# Altium schematic sheet Nutaq_Adaptor2.SchDoc: Adaptador Nutaq
size A4; Author: RCP; DrawnBy: RCP; Engineer: RCP
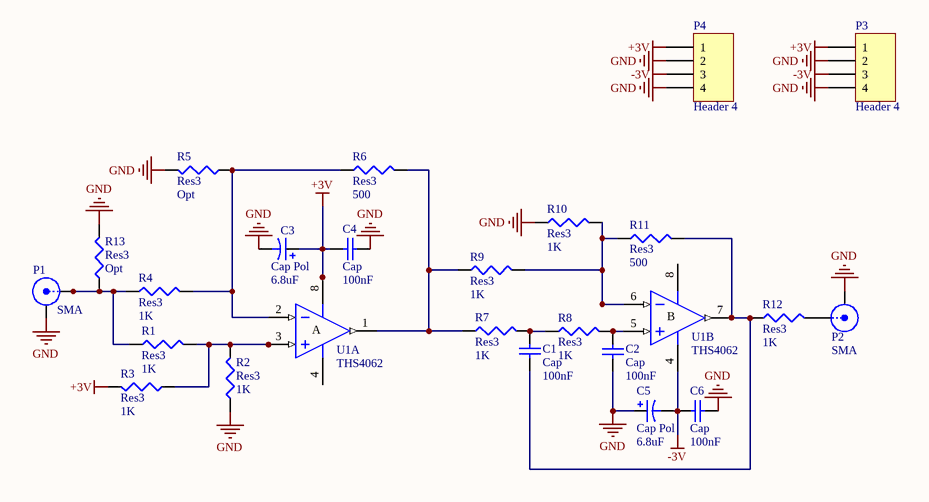
[diagram p0: Nutaq_Adaptor2.SchDoc]

## Parts
C1  Cap  value 100nF  [1608[0603]]
C2  Cap  value 100nF  [1608[0603]]
C3  Cap Pol  value 6.8uF  [1608[0603]]
C4  Cap  value 100nF  [1608[0603]]
C5  Cap Pol  value 6.8uF  [1608[0603]]
C6  Cap  value 100nF  [1608[0603]]
P1  SMA  [SMB_V-RJ45]
P2  SMA  [SMB_V-RJ45]
P3  Header 4  [HDR1X4]
P4  Header 4  [HDR1X4]
R1  Res3  value 1K  [J1-0603]
R2  Res3  value 1K  [J1-0603]
R3  Res3  value 1K  [J1-0603]
R4  Res3  value 1K  [J1-0603]
R5  Res3  value Opt  [J1-0603]
R6  Res3  value 500  [J1-0603]
R7  Res3  value 1K  [J1-0603]
R8  Res3  value 1K  [J1-0603]
R9  Res3  value 1K  [J1-0603]
R10  Res3  value 1K  [J1-0603]
R11  Res3  value 500  [J1-0603]
R12  Res3  value 1K  [J1-0603]
R13  Res3  value Opt  [J1-0603]
U1  THS4062  [SO-8_M]  (parts A,B of 2)

## Nets
+3V: C3.1 C4.1 P3.1 P4.1 R3.2 U1.8(V+)
-3V: C5.2 C6.1 P3.3 P4.3 U1.4(V-)
GND: C2.2 C3.2 C4.2 C5.1 C6.2 P1.2(Y) P2.2(Y) P3.2 P3.4 P4.2 P4.4 R2.1 R5.2 R10.1 R13.2
NetC1_1: C1.1 R7.2 R8.1
NetC1_2: C1.2 R11.2 R12.1 U1.7(OUT)
NetC2_1: C2.1 R8.2 U1.5(IN+)
NetP1_1: P1.1(X) R1.1 R4.1 R13.1
NetP2_1: P2.1(X) R12.2
NetR1_2: R1.2 R2.2 R3.1 U1.3(IN+)
NetR4_2: R4.2 R5.1 R6.1 U1.2(IN-)
NetR6_2: R6.2 R7.1 R9.1 U1.1(OUT)
NetR9_2: R9.2 R10.2 R11.1 U1.6(IN-)

## Notes on the sheet
- (in symbol AD8002AR, part A) A
- (in symbol AD8002AR, part B) B

## Library data of the parts
C1 C2 C4 C6 = Cap Semi: Capacitor (Semiconductor SIM Model); Published: 8-Jun-2000; LatestRevisionDate: 29-May-2009; LatestRevisionNote: IPC-7351 Footprint Added.; PackageReference: C1206; Publisher: Altium Limited; PackageDescription: Chip Capacitor
C3 C5 = Cap Pol3: Polarized Capacitor (Surface Mount); Published: 8-Jun-2000; LatestRevisionDate: 29-May-2009; LatestRevisionNote: IPC-7351 Footprint Added.; PackageReference: C0805; Publisher: Altium Limited; PackageDescription: Chip Capacitor
P1 P2 = SMB: SMB Straight Connector; LatestRevisionDate: 17-Jul-2002; LatestRevisionNote: Re-released for DXP Platform.; Publisher: Altium Limited
P3 P4 = Header 4: Header, 4-Pin; LatestRevisionDate: 17-Jul-2002; LatestRevisionNote: Re-released for DXP Platform.; Publisher: Altium Limited
R1-R13 = Res3: Resistor; Published: 8-Jun-2000; LatestRevisionDate: 29-May-2009; LatestRevisionNote: IPC-7351 Footprint Added.; PackageReference: J1-0603; Publisher: Altium Limited; PackageDescription: Chip Resistor
U1 = AD8002AR: Dual 600MHz, 50mW Current Feedback Amplifier; Published: 8-Jun-2000; LatestRevisionDate: 13-Apr-2006; LatestRevisionNote: IPC-7351 Footprint Added.; DatasheetVersion: REV. C 1999; PackageVersion: revA; PackageReference: SO-8; Publisher: Altium Limited; PackageDescription: 8-Pin Small Outline Integrated Circuit 1.27 mm Pitch; Code_JEDEC: MS-012-AA; Code_IPC: SOIC127P600-8; ComponentLink1Description: Manufacturer Link; ComponentLink1URL: http://www.analog.com/en/prod/0,,759_786_AD8002%2C00.html; ComponentLink2Description: Datasheet; ComponentLink2URL: http://www.analog.com/UploadedFiles/Data_Sheets/147523773AD8002_d.pdf